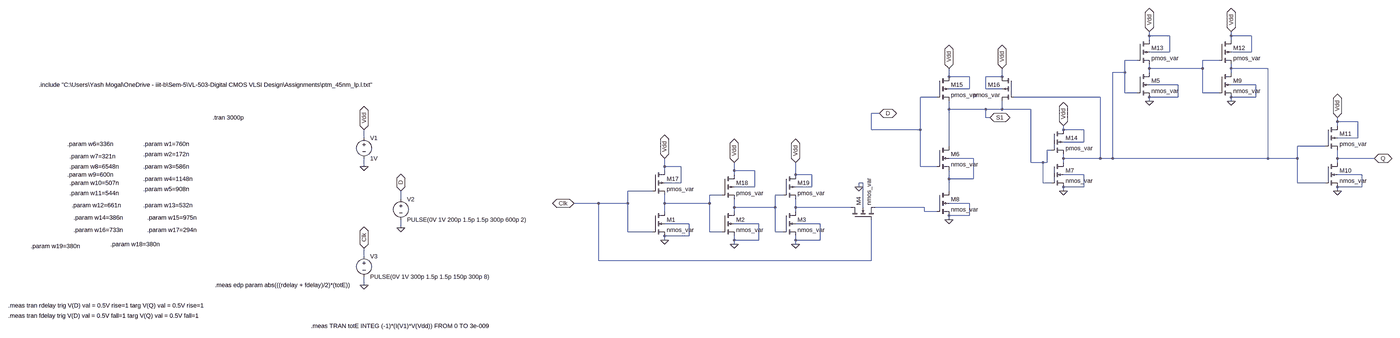
[diagram p0: schematic Project_MHLFF.asc, whole sheet]
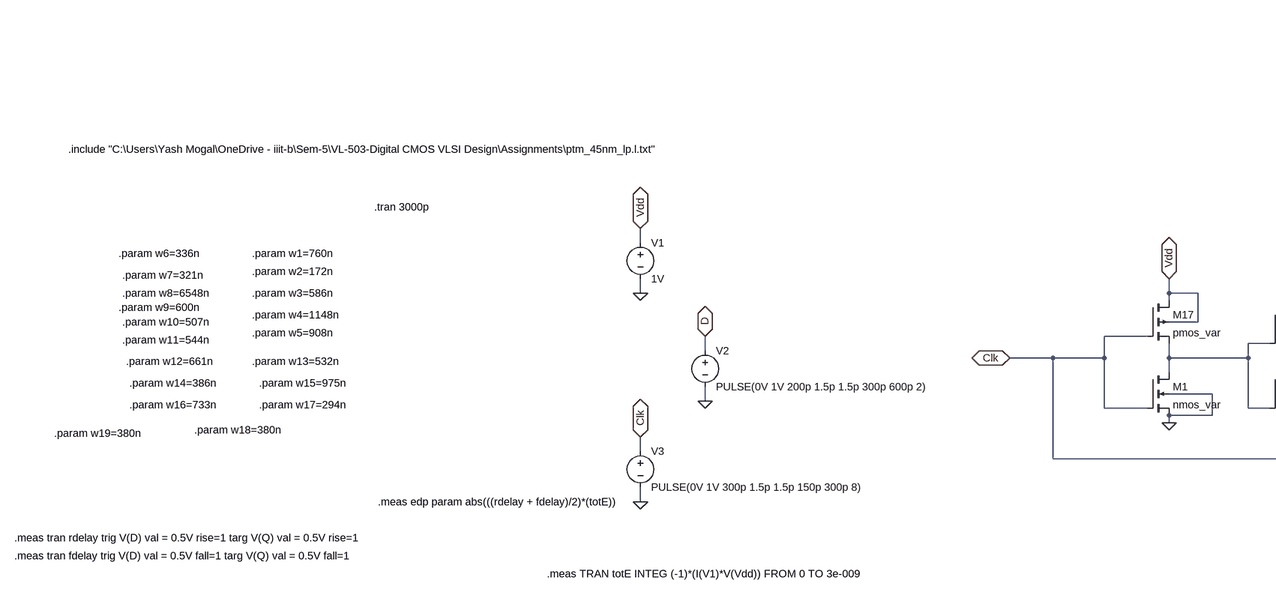
[diagram p1: schematic Project_MHLFF.asc, part, row 1 of 1, column 1 of 2]
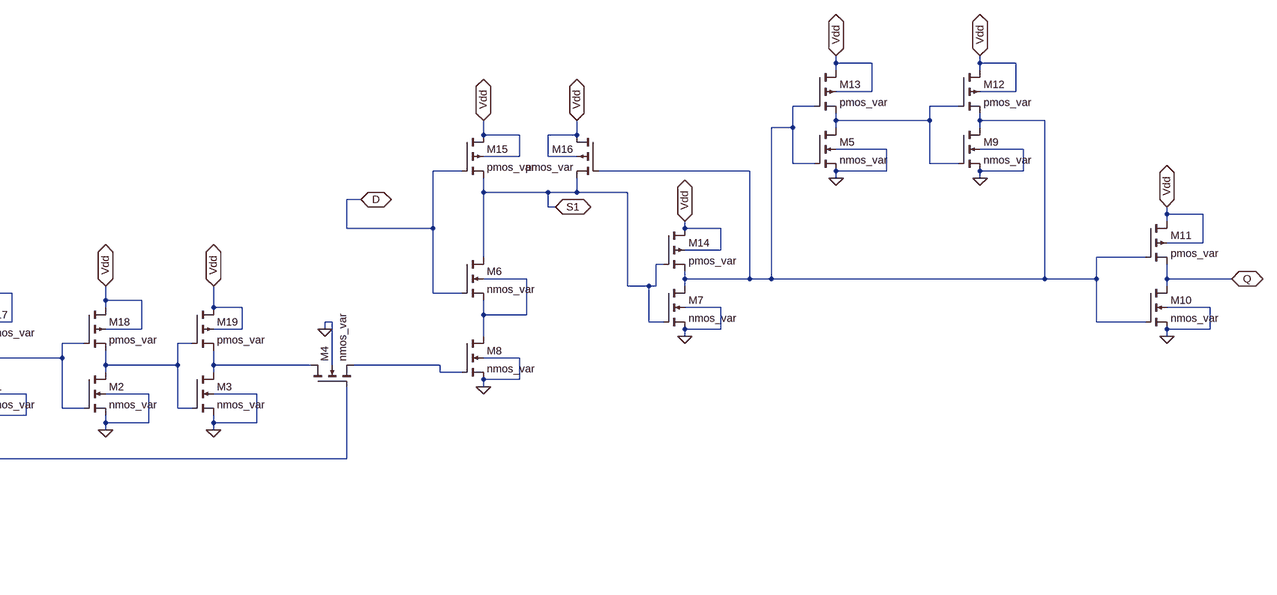
[diagram p2: schematic Project_MHLFF.asc, part, row 1 of 1, column 2 of 2]
Project_MHLFF.asc, the LTspice schematic file:
Version 4
SHEET 1 4204 680
WIRE 3200 -880 3200 -896
WIRE 3280 -880 3200 -880
WIRE 3520 -880 3520 -896
WIRE 3600 -880 3520 -880
WIRE 3200 -864 3200 -880
WIRE 3520 -864 3520 -880
WIRE 3280 -816 3280 -880
WIRE 3280 -816 3200 -816
WIRE 3600 -816 3600 -880
WIRE 3600 -816 3520 -816
WIRE 3152 -784 3104 -784
WIRE 3472 -784 3408 -784
WIRE 3200 -752 3200 -768
WIRE 3408 -752 3408 -784
WIRE 3408 -752 3200 -752
WIRE 3520 -752 3520 -768
WIRE 3664 -752 3520 -752
WIRE 3104 -736 3104 -784
WIRE 3104 -736 3056 -736
WIRE 3200 -736 3200 -752
WIRE 3520 -736 3520 -752
WIRE 2416 -720 2416 -752
WIRE 2496 -720 2416 -720
WIRE 2624 -720 2624 -752
WIRE 2624 -720 2560 -720
WIRE 3312 -688 3200 -688
WIRE 3616 -688 3520 -688
WIRE 2496 -672 2496 -720
WIRE 2496 -672 2416 -672
WIRE 2560 -672 2560 -720
WIRE 2624 -672 2560 -672
WIRE 3104 -656 3104 -736
WIRE 3152 -656 3104 -656
WIRE 3408 -656 3408 -752
WIRE 3472 -656 3408 -656
WIRE 2368 -640 2304 -640
WIRE 3008 -640 2672 -640
WIRE 3312 -640 3312 -688
WIRE 3312 -640 3200 -640
WIRE 3616 -640 3616 -688
WIRE 3616 -640 3520 -640
WIRE 3200 -624 3200 -640
WIRE 3520 -624 3520 -640
WIRE 2416 -592 2416 -624
WIRE 2560 -592 2416 -592
WIRE 2624 -592 2624 -624
WIRE 2624 -592 2560 -592
WIRE 2736 -592 2624 -592
WIRE 2144 -576 2112 -576
WIRE 2560 -560 2560 -592
WIRE 2576 -560 2560 -560
WIRE 3984 -544 3984 -560
WIRE 4064 -544 3984 -544
WIRE 3984 -528 3984 -544
WIRE 2112 -512 2112 -576
WIRE 2304 -512 2304 -640
WIRE 2304 -512 2112 -512
WIRE 2864 -512 2864 -528
WIRE 2944 -512 2864 -512
WIRE -240 -480 -240 -512
WIRE 4064 -480 4064 -544
WIRE 4064 -480 3984 -480
WIRE 2944 -464 2944 -512
WIRE 2944 -464 2864 -464
WIRE 2416 -448 2416 -592
WIRE 3936 -448 3824 -448
WIRE 2816 -432 2800 -432
WIRE 2512 -400 2416 -400
WIRE 2864 -400 2864 -416
WIRE 3008 -400 3008 -640
WIRE 3008 -400 2864 -400
WIRE 3056 -400 3056 -736
WIRE 3056 -400 3008 -400
WIRE 3664 -400 3664 -752
WIRE 3664 -400 3056 -400
WIRE 3824 -400 3824 -448
WIRE 3824 -400 3664 -400
WIRE 3984 -400 3984 -432
WIRE 4128 -400 3984 -400
WIRE 2736 -384 2736 -592
WIRE 2784 -384 2736 -384
WIRE 2800 -384 2800 -432
WIRE 2800 -384 2784 -384
WIRE 2864 -384 2864 -400
WIRE 3984 -384 3984 -400
WIRE -240 -368 -240 -400
WIRE 1264 -368 1264 -400
WIRE 1328 -368 1264 -368
WIRE 2304 -368 2304 -512
WIRE 2368 -368 2304 -368
WIRE 1264 -352 1264 -368
WIRE 1536 -352 1536 -384
WIRE 1616 -352 1536 -352
WIRE 1536 -336 1536 -352
WIRE 1776 -336 1776 -384
WIRE 1840 -336 1776 -336
WIRE 2944 -336 2864 -336
WIRE 4080 -336 3984 -336
WIRE 2416 -320 2416 -352
WIRE 2512 -320 2512 -400
WIRE 2512 -320 2416 -320
WIRE 1328 -304 1328 -368
WIRE 1328 -304 1264 -304
WIRE 2080 -304 2064 -304
WIRE 2784 -304 2784 -384
WIRE 2816 -304 2784 -304
WIRE 3824 -304 3824 -400
WIRE 3936 -304 3824 -304
WIRE 1616 -288 1616 -352
WIRE 1616 -288 1536 -288
WIRE 1840 -288 1840 -336
WIRE 1840 -288 1776 -288
WIRE 2064 -288 2064 -304
WIRE 2944 -288 2944 -336
WIRE 2944 -288 2864 -288
WIRE 4080 -288 4080 -336
WIRE 4080 -288 3984 -288
WIRE 1216 -272 1120 -272
WIRE 2416 -272 2416 -320
WIRE 2864 -272 2864 -288
WIRE 3984 -272 3984 -288
WIRE 1488 -256 1440 -256
WIRE 1728 -256 1696 -256
WIRE -96 -240 -96 -272
WIRE 992 -224 896 -224
WIRE 1120 -224 1120 -272
WIRE 1120 -224 992 -224
WIRE 1264 -224 1264 -256
WIRE 1440 -224 1440 -256
WIRE 1440 -224 1264 -224
WIRE 2496 -224 2416 -224
WIRE 1536 -208 1536 -240
WIRE 1696 -208 1696 -256
WIRE 1696 -208 1536 -208
WIRE 1776 -208 1776 -240
WIRE 2032 -208 1776 -208
WIRE 2080 -208 2080 -304
WIRE 2320 -208 2128 -208
WIRE 1264 -192 1264 -224
WIRE 1536 -192 1536 -208
WIRE 1776 -192 1776 -208
WIRE 2320 -192 2320 -208
WIRE 2368 -192 2320 -192
WIRE 2496 -176 2496 -224
WIRE 2496 -176 2416 -176
WIRE 2416 -160 2416 -176
WIRE 1360 -144 1264 -144
WIRE 1632 -144 1536 -144
WIRE 1872 -144 1776 -144
WIRE -96 -128 -96 -160
WIRE 1120 -112 1120 -224
WIRE 1216 -112 1120 -112
WIRE 1440 -112 1440 -224
WIRE 1488 -112 1440 -112
WIRE 1696 -112 1696 -208
WIRE 1728 -112 1696 -112
WIRE 1360 -96 1360 -144
WIRE 1360 -96 1264 -96
WIRE 1264 -80 1264 -96
WIRE 1536 -80 1536 -96
WIRE 1632 -80 1632 -144
WIRE 1632 -80 1536 -80
WIRE 1776 -80 1776 -96
WIRE 1872 -80 1872 -144
WIRE 1872 -80 1776 -80
WIRE 1536 -64 1536 -80
WIRE 1776 -64 1776 -80
WIRE -240 -16 -240 -48
WIRE 992 0 992 -224
WIRE 2112 0 2112 -160
WIRE 2112 0 992 0
WIRE -240 96 -240 64
FLAG -240 -368 0
FLAG -96 -128 0
FLAG -240 96 0
FLAG -240 -512 Vdd
IOPIN -240 -512 BiDir
FLAG -96 -272 D
IOPIN -96 -272 BiDir
FLAG -240 -48 Clk
IOPIN -240 -48 BiDir
FLAG 1264 -400 Vdd
IOPIN 1264 -400 BiDir
FLAG 1536 -384 Vdd
IOPIN 1536 -384 BiDir
FLAG 1776 -384 Vdd
IOPIN 1776 -384 BiDir
FLAG 2416 -752 Vdd
IOPIN 2416 -752 BiDir
FLAG 2624 -752 Vdd
IOPIN 2624 -752 BiDir
FLAG 2864 -528 Vdd
IOPIN 2864 -528 BiDir
FLAG 3200 -896 Vdd
IOPIN 3200 -896 BiDir
FLAG 3520 -896 Vdd
IOPIN 3520 -896 BiDir
FLAG 3984 -560 Vdd
IOPIN 3984 -560 BiDir
FLAG 1264 -80 0
FLAG 1536 -64 0
FLAG 1776 -64 0
FLAG 2064 -288 0
FLAG 2416 -160 0
FLAG 2864 -272 0
FLAG 3200 -624 0
FLAG 3520 -624 0
FLAG 3984 -272 0
FLAG 896 -224 Clk
IOPIN 896 -224 BiDir
FLAG 2144 -576 D
IOPIN 2144 -576 BiDir
FLAG 2576 -560 S1
IOPIN 2576 -560 BiDir
FLAG 4128 -400 Q
IOPIN 4128 -400 BiDir
SYMBOL voltage -240 -496 R0
WINDOW 123 0 0 Left 0
WINDOW 39 0 0 Left 0
SYMATTR InstName V1
SYMATTR Value 1V
SYMBOL voltage -96 -256 R0
WINDOW 123 0 0 Left 0
WINDOW 39 0 0 Left 0
SYMATTR InstName V2
SYMATTR Value PULSE(0V 1V 200p 1.5p 1.5p 300p 600p 2)
SYMBOL voltage -240 -32 R0
WINDOW 123 0 0 Left 0
WINDOW 39 0 0 Left 0
SYMATTR InstName V3
SYMATTR Value PULSE(0V 1V 300p 1.5p 1.5p 150p 300p 8)
SYMBOL nmos4 1216 -192 R0
SYMATTR InstName M1
SYMATTR Value nmos_var
SYMATTR Value2 l=45nm w=w2
SYMBOL nmos4 1488 -192 R0
SYMATTR InstName M2
SYMATTR Value nmos_var
SYMATTR Value2 l=45nm w=w4
SYMBOL nmos4 1728 -192 R0
SYMATTR InstName M3
SYMATTR Value nmos_var
SYMATTR Value2 l=45nm w=w6
SYMBOL nmos4 2032 -160 R270
SYMATTR InstName M4
SYMATTR Value nmos_var
SYMATTR Value2 l=45nm w=w7
SYMBOL nmos4 2368 -448 R0
SYMATTR InstName M6
SYMATTR Value nmos_var
SYMATTR Value2 l=45nm w=w10
SYMBOL nmos4 2816 -384 R0
SYMATTR InstName M7
SYMATTR Value nmos_var
SYMATTR Value2 l=w13
SYMBOL nmos4 2368 -272 R0
SYMATTR InstName M8
SYMATTR Value nmos_var
SYMATTR Value2 l=45nm w=w11
SYMBOL nmos4 3152 -736 R0
SYMATTR InstName M5
SYMATTR Value nmos_var
SYMATTR Value2 l=45nm w=w15
SYMBOL nmos4 3472 -736 R0
SYMATTR InstName M9
SYMATTR Value nmos_var
SYMATTR Value2 l=45nm w=w17
SYMBOL nmos4 3936 -384 R0
SYMATTR InstName M10
SYMATTR Value nmos_var
SYMATTR Value2 l=45nm w=w19
SYMBOL pmos4 3936 -528 R0
SYMATTR InstName M11
SYMATTR Value pmos_var
SYMATTR Value2 l=45nm w=w18
SYMBOL pmos4 3472 -864 R0
SYMATTR InstName M12
SYMATTR Value pmos_var
SYMATTR Value2 l=45nm w=w16
SYMBOL pmos4 3152 -864 R0
SYMATTR InstName M13
SYMATTR Value pmos_var
SYMATTR Value2 l=45nm w=w14
SYMBOL pmos4 2816 -512 R0
SYMATTR InstName M14
SYMATTR Value pmos_var
SYMATTR Value2 l=45nm w=w12
SYMBOL pmos4 2368 -720 R0
SYMATTR InstName M15
SYMATTR Value pmos_var
SYMATTR Value2 l=45nm w=w8
SYMBOL pmos4 2672 -720 M0
SYMATTR InstName M16
SYMATTR Value pmos_var
SYMATTR Value2 l=45nm w=w9
SYMBOL pmos4 1216 -352 R0
SYMATTR InstName M17
SYMATTR Value pmos_var
SYMATTR Value2 l=45nm w=w1
SYMBOL pmos4 1488 -336 R0
SYMATTR InstName M18
SYMATTR Value pmos_var
SYMATTR Value2 l=45nm w=w3
SYMBOL pmos4 1728 -336 R0
SYMATTR InstName M19
SYMATTR Value pmos_var
SYMATTR Value2 l=45nm w=w5
TEXT -448 256 Left 2 !.meas TRAN totE INTEG (-1)*(I(V1)*V(Vdd)) FROM 0 TO 3e-009
TEXT -1104 -456 Left 2 !.param w1=760n
TEXT -1104 -416 Left 2 !.param w2=172n
TEXT -1104 -368 Left 2 !.param w3=586n
TEXT -1104 -320 Left 2 !.param w4=1148n
TEXT -1104 -280 Left 2 !.param w5=908n
TEXT -1400 -456 Left 2 !.param w6=336n
TEXT -1392 -408 Left 2 !.param w7=321n
TEXT -1392 -368 Left 2 !.param w8=6548n
TEXT -1400 -336 Left 2 !.param w9=600n
TEXT -1392 -304 Left 2 !.param w10=507n
TEXT -1392 -264 Left 2 !.param w11=544n
TEXT -1384 -216 Left 2 !.param w12=661n
TEXT -1104 -216 Left 2 !.param w13=532n
TEXT -1376 -168 Left 2 !.param w14=386n
TEXT -1088 -168 Left 2 !.param w15=975n
TEXT -1376 -120 Left 2 !.param w16=733n
TEXT -1088 -120 Left 2 !.param w17=294n
TEXT -1232 -64 Left 2 !.param w18=380n
TEXT -824 96 Left 2 !.meas edp param abs(((rdelay + fdelay)/2)*(totE))
TEXT -832 -560 Left 2 !.tran 3000p
TEXT -1512 -688 Left 2 !.include "C:\\Users\\Yash Mogal\\OneDrive - iiit-b\\Sem-5\\VL-503-Digital CMOS VLSI Design\\Assignments\\ptm_45nm_lp.l.txt"
TEXT -1544 -56 Left 2 !.param w19=380n
TEXT -1632 176 Left 2 !.meas tran rdelay trig V(D) val = 0.5V rise=1 targ V(Q) val = 0.5V rise=1
TEXT -1632 216 Left 2 !.meas tran fdelay trig V(D) val = 0.5V fall=1 targ V(Q) val = 0.5V fall=1

The netlist it stands for:
* Project_MHLFF.asc
V1 Vdd 0 1V
V2 D 0 PULSE(0V 1V 200p 1.5p 1.5p 300p 600p 2)
V3 Clk 0 PULSE(0V 1V 300p 1.5p 1.5p 150p 300p 8)
M1 N004 Clk 0 0 nmos_var l=45nm w=w2
M2 N005 N004 0 0 nmos_var l=45nm w=w4
M3 N006 N005 0 0 nmos_var l=45nm w=w6
M4 N006 Clk N007 0 nmos_var l=45nm w=w7
M6 S1 D N003 N003 nmos_var l=45nm w=w10
M7 N001 S1 0 0 nmos_var l=w13
M8 N003 N007 0 0 nmos_var l=45nm w=w11
M5 N002 N001 0 0 nmos_var l=45nm w=w15
M9 N001 N002 0 0 nmos_var l=45nm w=w17
M10 Q N001 0 0 nmos_var l=45nm w=w19
M11 Vdd N001 Q Vdd pmos_var l=45nm w=w18
M12 Vdd N002 N001 Vdd pmos_var l=45nm w=w16
M13 Vdd N001 N002 Vdd pmos_var l=45nm w=w14
M14 Vdd S1 N001 Vdd pmos_var l=45nm w=w12
M15 Vdd D S1 Vdd pmos_var l=45nm w=w8
M16 Vdd N001 S1 Vdd pmos_var l=45nm w=w9
M17 Vdd Clk N004 Vdd pmos_var l=45nm w=w1
M18 Vdd N004 N005 Vdd pmos_var l=45nm w=w3
M19 Vdd N005 N006 Vdd pmos_var l=45nm w=w5
.model NMOS NMOS
.model PMOS PMOS
.lib standard.mos
.meas TRAN totE INTEG (-1)*(I(V1)*V(Vdd)) FROM 0 TO 3e-009
.param w1=760n
.param w2=172n
.param w3=586n
.param w4=1148n
.param w5=908n
.param w6=336n
.param w7=321n
.param w8=6548n
.param w9=600n
.param w10=507n
.param w11=544n
.param w12=661n
.param w13=532n
.param w14=386n
.param w15=975n
.param w16=733n
.param w17=294n
.param w18=380n
.meas edp param abs(((rdelay + fdelay)/2)*(totE))
.tran 3000p
.include "C:\Users\Yash Mogal\OneDrive - iiit-b\Sem-5\VL-503-Digital CMOS VLSI Design\Assignments\ptm_45nm_lp.l.txt"
.param w19=380n
.meas tran rdelay trig V(D) val = 0.5V rise=1 targ V(Q) val = 0.5V rise=1
.meas tran fdelay trig V(D) val = 0.5V fall=1 targ V(Q) val = 0.5V fall=1
.backanno
.end